# EAGLE design dcboard2 (EAGLE 8.4.3)
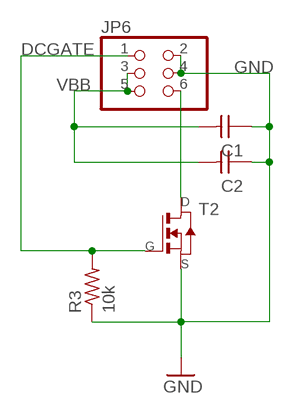
[diagram p0: schematic, sheet 1]

## Parts
C1  CAP-UNPOLARIZEDFAB  [C1206FAB]
C2  CAP-UNPOLARIZEDFAB  [C1206FAB]
JP6  PINHD-2X3-SMD  [2X03SMD]
R3  10k  RES-US1206FAB  [R1206FAB]
T2  NMOSFETTO252  [TO252]

## Nets
DCGATE: JP6.1 R3.2 T2.1(G)
GND: C1.1 C2.1 JP6.2 JP6.4 R3.1 T2.2(S)
N$1: JP6.6 T2.3(D)
VBB: C1.2 C2.2 JP6.3 JP6.5

## Library data of the parts
C1 C2 = fab:CAP-UNPOLARIZED
JP6 = fab:PINHD-2X3-SMD: PIN HEADER
R3 = fab:RES-US: Resistor (US Symbol) Variants with postfix FAB are widened to allow the routing of internal traces
T2 = fab:NMOSFET: MOS FET

## Board
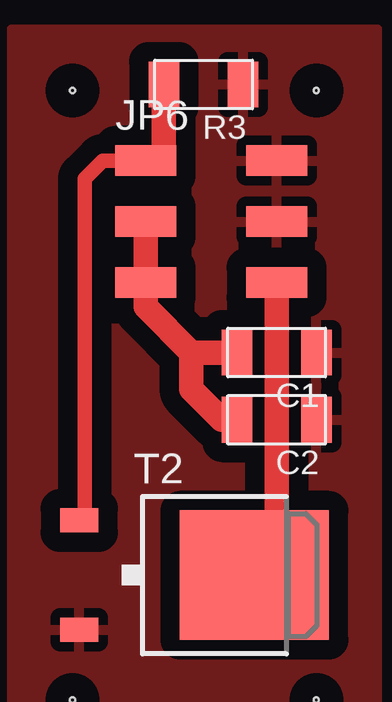
[diagram p1: board, top side]

No outline drawn. Coordinates in mm, seen from the top.
Copper layers (1*16): Top 0.035mm / dielectric 1.5mm / Bottom 0.035mm
Design rules "fab *": minimum track width 0.3mm, minimum drill 32mil, track to track 0.397mm, track to pad 0.397mm, pad to pad 0.397mm, via to via 0.397mm, smd to smd 0.397mm, copper to edge 40mil, drill to drill 16mil, minimum pad ring 10mil, minimum via ring 8mil, stop-mask expansion 4mil, vias tented up to drill 0mil, thermal gap 16mil
Holes 0.2 mm at 2.54,27.94 2.54,2.54 12.7,2.54 12.7,27.94

### Footprints (pad centres in the part's own frame; a part is rotated, then mirrored left to right if it is on the bottom)
C1206FAB = smd 1.27 x 1.905: 1 -1.651,0; 2 1.651,0
2X03SMD = smd 2.54 x 1.27: 1 -2.54,2.54; 2 2.92,2.54; 3 -2.54,0; 4 2.92,0; 5 -2.54,-2.54; 6 2.92,-2.54
R1206FAB = smd 1.27 x 1.905: 1 -1.651,0; 2 1.651,0
TO252 = smd 1 x 1.6: 1 -2.28,-4.8; 2 2.28,-4.8 | smd 5.4 x 6.2: 3 0,2.5

### Placement (x,y rotation side)
C1  11.05,17.02 180 top
C2  11.05,14.22 180 top
JP6  8.13,22.48 0 top
R3  8,28.19 180 top
T2  7.62,7.75 270 top

### Tracks (layer width: path | path; a pad name or v marks a point on that pad's centre or on a via)
DCGATE
  Top 0.61: 6.35,25.02 JP6.1 3.81,25.02 3.05,24.26 3.05,10.13 T2.1
  Top 1.016: R3.2 6.35,25.02
GND
  pour Top (isolate 0.813): 15.24,30.48 0,30.48 0,0 15.24,0
N$1
  Top 0.3: 11.3,20.45 JP6.6
  Top 0.61: 11.05,8.55 T2.3
  Top 1.016: JP6.6 11.05,8.55
VBB
  Top 1.016: JP6.3 JP6.5 5.59,18.92 7.49,17.02 | 7.49,17.02 C1.2 | C2.2 8.76,14.22 7.49,15.49 7.49,17.02